# Altium schematic sheet USB.SchDoc
size A
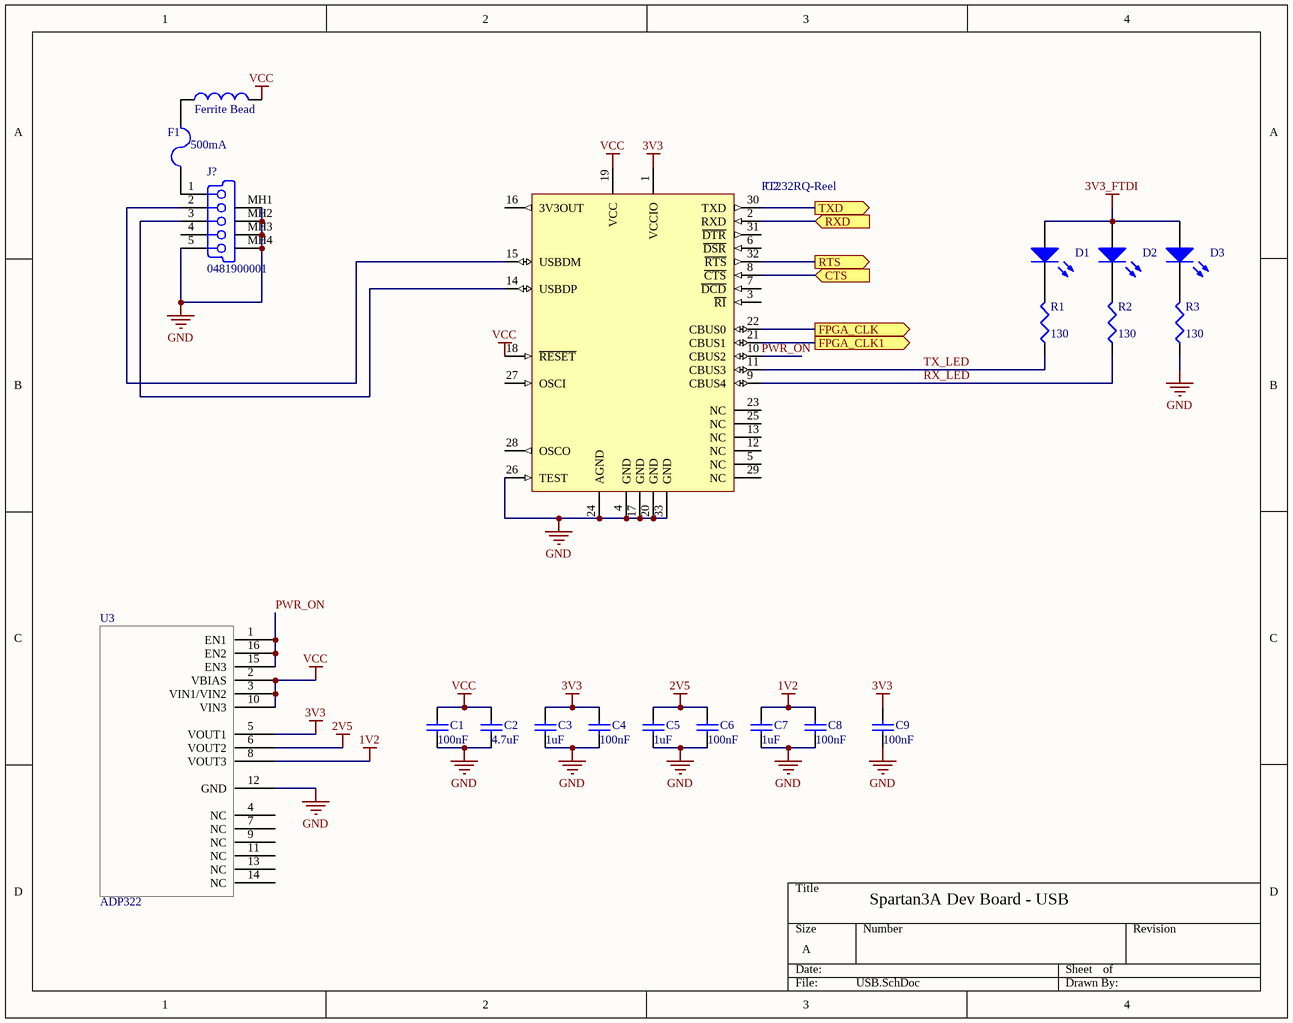
[diagram p0: USB.SchDoc]

## Parts
C1  value 100nF  [1608[0603]]  (hidden comment: Cap Semi)
C2  value 4.7uF  [1608[0603]]  (hidden comment: Cap Semi)
C3  value 1uF  [1608[0603]]  (hidden comment: Cap Semi)
C4  value 100nF  [1608[0603]]  (hidden comment: Cap Semi)
C5  value 1uF  [1608[0603]]  (hidden comment: Cap Semi)
C6  value 100nF  [1608[0603]]  (hidden comment: Cap Semi)
C7  value 1uF  [1608[0603]]  (hidden comment: Cap Semi)
C8  value 100nF  [1608[0603]]  (hidden comment: Cap Semi)
C9  value 100nF  [1608[0603]]  (hidden comment: Cap Semi)
D1  LED3  [1608[0603]]  (value not drawn)
D2  LED3  [1608[0603]]  (value not drawn)
D3  LED3  [1608[0603]]  (value not drawn)
F1  500mA  [1608[0603]]
FB1  Ferrite Bead  [1608[0603]]
J?  0481900001  [481900001]
R1  value 130  [J1-0603]  (hidden comment: Res3)
R2  value 130  [J1-0603]  (hidden comment: Res3)
R3  value 130  [J1-0603]  (hidden comment: Res3)
U2  FT232RQ-Reel  [PQFN5X5-32_V]
U3  ADP322  [QFN16_N]

## Ports
CTS (in), FPGA_CLK1 (out), FPGA_CLK (out), RTS (out), RXD (in), TXD (out)

## Nets
1V2: C7.2 C8.2 U3.8(VOUT3)
2V5: C5.2 C6.2 U3.6(VOUT2)
3V3: C3.2 C4.2 C9.2 U2.1(VCCIO) U3.5(VOUT1)
3V3_FTDI: D1.1(A) D2.1(A) D3.1(A)
GND: C1.1 C2.1 C3.1 C4.1 C5.1 C6.1 C7.1 C8.1 C9.1 J?.5(GND) J?.MH1(Tab) J?.MH2(Tab) J?.MH3(Tab) J?.MH4(Tab) R3.1 U2.4(GND) U2.17(GND) U2.20(GND) U2.24(AGND) U2.26(TEST) U2.33(GND) U3.12(GND)
VCC: C1.2 C2.2 FB1.2 U2.18(~{RESET}) U2.19(VCC) U3.2(VBIAS) U3.3(VIN1/VIN2) U3.10(VIN3)
CTS: U2.8(~{CTS}) ; port CTS
FPGA_CLK: U2.22(CBUS0) ; port FPGA_CLK
FPGA_CLK1: U2.21(CBUS1) ; port FPGA_CLK1
PWR_ON: U2.10(CBUS2) U3.1(EN1) U3.15(EN3) U3.16(EN2)
RTS: U2.32(~{RTS}) ; port RTS
RX_LED: R2.1 U2.9(CBUS4)
RXD: U2.2(RXD) ; port RXD
TX_LED: R1.1 U2.11(CBUS3)
TXD: U2.30(TXD) ; port TXD
NetD1_2: D1.2(K) R1.2
NetD2_2: D2.2(K) R2.2
NetD3_2: D3.2(K) R3.2
NetF1_1: F1.1 J?.1(V_BUS_(5V))
NetF1_2: F1.2 FB1.1
NetJ?_2: J?.2(D-) U2.15(USBDM)
NetJ?_3: J?.3(D+) U2.14(USBDP)

Not connected (* = marked no-connect by the designer): J? 4(NC); U2 3(~{RI}) 5(NC) 6(~{DSR}) 7(~{DCD}) 12(NC) 13(NC) 16(3V3OUT) 23(NC) 25(NC) 27(OSCI) 28(OSCO) 29(NC) 31(~{DTR}); U3 4(NC) 7(NC) 9(NC) 11(NC) 13(NC) 14(NC)

## Notes on the sheet
- Spartan3A Dev Board - USB

## Library data of the parts
C1-C9 = Cap Semi: Capacitor (Semiconductor SIM Model); Published: 8-Jun-2000; LatestRevisionDate: 29-May-2009; LatestRevisionNote: IPC-7351 Footprint Added.; PackageReference: C1206; Publisher: Altium Limited; PackageDescription: Chip Capacitor
D1-D3 = LED3: Typical BLUE SiC LED; Published: 8-Jun-2000; LatestRevisionDate: 17-Dec-2003; LatestRevisionNote: PCB Footprint replaced.; DatasheetVersion: 16-Apr-2002; PackageVersion: 16-Apr-2002; PackageReference: 3.5X2.8X1.9; Publisher: Altium Limited; PackageDescription: SM LED; 2 C-Bend Leads; Body 3.5 x 2.8 x 1.9 mm, inc leads (LxWxH typ)
F1 = Fuse 2: Fuse; Published: 8-Jun-2000; LatestRevisionDate: 17-Jul-2002; LatestRevisionNote: Re-released for DXP Platform.; PackageReference: PIN-W2/E2.8; Publisher: Altium Limited; PackageDescription: Thru-Hole; 2 Leads
FB1 = Inductor: Code_IEC: 1005; Value: 10mH; Published: 8-Jun-2000; LatestRevisionDate: 29-May-2009; LatestRevisionNote: IPC-7351 Footprint Added.; PackageReference: 0402-A; Publisher: Altium Limited; PackageDescription: Chip Inductor; Code_JEITA: 0402
J? = 0481900001: USB On-The-Go (OTG) Mini-B Receptacle, Right Angle, SMT, 0.80mm (.031") Pitch, Solder Tabs with Back Cover, Recessed Type; PCB_Layout: Complies with Manufacturer's Recommendation.; Published: 21-Sep-2007; DatasheetVersion: revA, May-2004; PackageVersion: May-2004; PackageReference: 481900001; Publisher: Altium Limited; PackageDescription: USB Mini-B, Sinking Type, SM; 5 Position; Right Angle, Body 11.45 x 11.8 x 3.9 mm (LxWxH); ComponentLink1Description: Manufacturer Link; ComponentLink1URL: http://www.molex.com/; ComponentLink2Description: Datasheet; ComponentLink2URL: http://www.molex.com/cmc_upload/0/000/895/958/SD-48190-001RevA.pdf
R1-R3 = Res3: Resistor; Published: 8-Jun-2000; LatestRevisionDate: 29-May-2009; LatestRevisionNote: IPC-7351 Footprint Added.; PackageReference: J1-0603; Publisher: Altium Limited; PackageDescription: Chip Resistor
U2 = FT232RQ-Reel: USB UART Asynchronous Serial Data Transfer Chip, QFN-32, Tape and Reel; Published: 19-Aug-2010; DatasheetVersion: ver 2.07, Jul-2010; PackageVersion: 2010; PackageReference: PQFN5X5-32; Publisher: Altium Limited; PackageDescription: 32-Pin Quad Flat No-Lead 0.5 mm Pitch, Pullback, 3.2 x 3.2 mm Exposed Pad; ComponentLink1Description: Manufacturer Link; ComponentLink1URL: http://www.ftdichip.com/Products/ICs/FT232R.htm; ComponentLink2Description: Datasheet; ComponentLink2URL: http://www.ftdichip.com/Support/Documents/DataSheets/ICs/DS_FT232R.pdf
U3 = Component_1